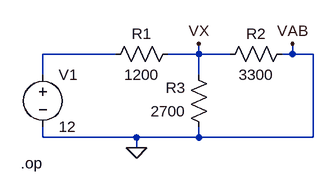
[diagram p0: schematic thevenin1.asc]
thevenin1.asc, the LTspice schematic file:
Version 4
SHEET 1 880 680
WIRE 32 112 -80 112
WIRE 160 112 160 96
WIRE 160 112 112 112
WIRE 208 112 160 112
WIRE 304 112 304 96
WIRE 304 112 288 112
WIRE 336 112 304 112
WIRE -80 144 -80 112
WIRE 160 144 160 112
WIRE -80 240 -80 224
WIRE 64 240 -80 240
WIRE 160 240 160 224
WIRE 160 240 64 240
WIRE 336 240 336 112
WIRE 336 240 160 240
WIRE 64 256 64 240
FLAG 64 256 0
FLAG 160 96 VX
FLAG 304 96 VAB
SYMBOL res 128 96 R90
WINDOW 0 0 56 VBottom 2
WINDOW 3 32 56 VTop 2
SYMATTR InstName R1
SYMATTR Value 1200
SYMBOL res 304 96 R90
WINDOW 0 0 56 VBottom 2
WINDOW 3 32 56 VTop 2
SYMATTR InstName R2
SYMATTR Value 3300
SYMBOL res 176 240 R180
WINDOW 0 36 76 Left 2
WINDOW 3 36 40 Left 2
SYMATTR InstName R3
SYMATTR Value 2700
SYMBOL voltage -80 128 R0
WINDOW 123 0 0 Left 0
WINDOW 39 0 0 Left 0
SYMATTR InstName V1
SYMATTR Value 12
TEXT -114 280 Left 2 !.op

The netlist it stands for:
* thevenin1.asc
R1 VX N001 1200
R2 0 VX 3300
R3 0 VX 2700
V1 N001 0 12
.op
.backanno
.end